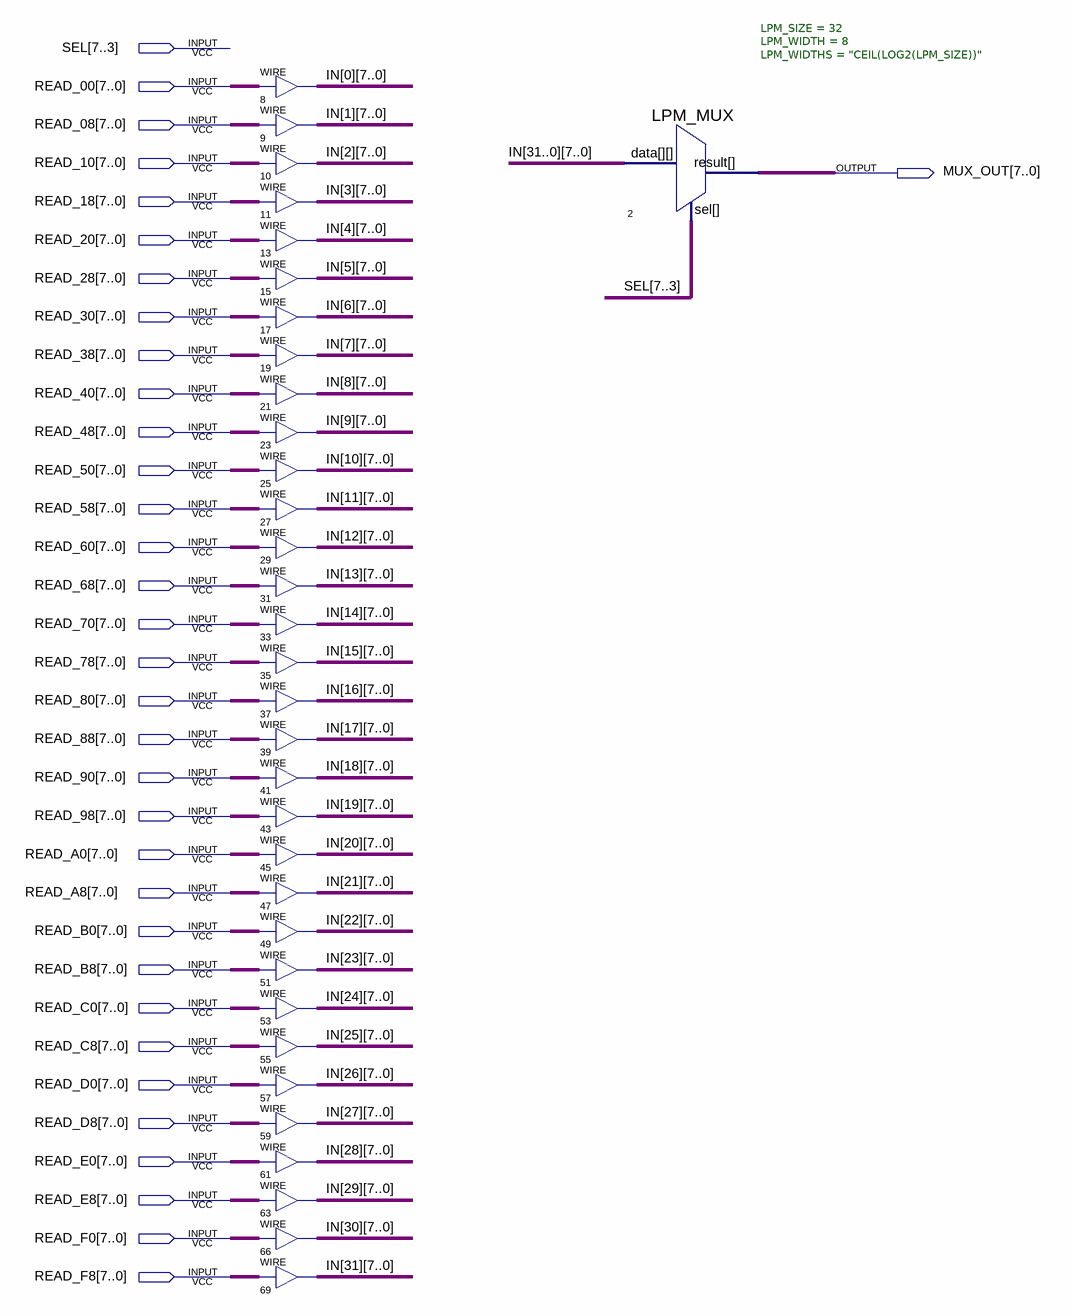
[diagram p0: schematic sheet]
// Quartus schematic mux32.bdf as structural Verilog: 33 symbols, 34 pins
module mux32 (
  input  [7:3] SEL,
  input  [7:0] READ_00,
  input  [7:0] READ_08,
  input  [7:0] READ_10,
  input  [7:0] READ_18,
  input  [7:0] READ_20,
  input  [7:0] READ_28,
  input  [7:0] READ_30,
  input  [7:0] READ_38,
  input  [7:0] READ_40,
  input  [7:0] READ_48,
  input  [7:0] READ_50,
  input  [7:0] READ_58,
  input  [7:0] READ_60,
  input  [7:0] READ_68,
  input  [7:0] READ_70,
  input  [7:0] READ_78,
  input  [7:0] READ_80,
  input  [7:0] READ_88,
  input  [7:0] READ_90,
  input  [7:0] READ_98,
  input  [7:0] READ_A0,
  input  [7:0] READ_A8,
  input  [7:0] READ_B0,
  input  [7:0] READ_B8,
  input  [7:0] READ_C0,
  input  [7:0] READ_C8,
  input  [7:0] READ_D0,
  input  [7:0] READ_D8,
  input  [7:0] READ_E0,
  input  [7:0] READ_E8,
  input  [7:0] READ_F0,
  input  [7:0] READ_F8,
  output [7:0] MUX_OUT
);

  wire [7:0] IN_0, IN_1, IN_2, IN_3, IN_4, IN_5, IN_6, IN_7, IN_8, IN_9, IN_10, IN_11, IN_12, IN_13, IN_14,
       IN_15, IN_16, IN_17, IN_18, IN_19, IN_20, IN_21, IN_22, IN_23, IN_24, IN_25, IN_26, IN_27, IN_28,
       IN_29, IN_30, IN_31;

  assign IN_0 = READ_00;  // WIRE 8
  assign IN_1 = READ_08;  // WIRE 9
  assign IN_2 = READ_10;  // WIRE 10
  assign IN_3 = READ_18;  // WIRE 11
  assign IN_4 = READ_20;  // WIRE 13
  assign IN_5 = READ_28;  // WIRE 15
  assign IN_6 = READ_30;  // WIRE 17
  assign IN_7 = READ_38;  // WIRE 19
  assign IN_8 = READ_40;  // WIRE 21
  assign IN_9 = READ_48;  // WIRE 23
  assign IN_10 = READ_50;  // WIRE 25
  assign IN_11 = READ_58;  // WIRE 27
  assign IN_12 = READ_60;  // WIRE 29
  assign IN_13 = READ_68;  // WIRE 31
  assign IN_14 = READ_70;  // WIRE 33
  assign IN_15 = READ_78;  // WIRE 35
  assign IN_16 = READ_80;  // WIRE 37
  assign IN_17 = READ_88;  // WIRE 39
  assign IN_18 = READ_90;  // WIRE 41
  assign IN_19 = READ_98;  // WIRE 43
  assign IN_20 = READ_A0;  // WIRE 45
  assign IN_21 = READ_A8;  // WIRE 47
  assign IN_22 = READ_B0;  // WIRE 49
  assign IN_23 = READ_B8;  // WIRE 51
  assign IN_24 = READ_C0;  // WIRE 53
  assign IN_25 = READ_C8;  // WIRE 55
  assign IN_26 = READ_D0;  // WIRE 57
  assign IN_27 = READ_D8;  // WIRE 59
  assign IN_28 = READ_E0;  // WIRE 61
  assign IN_29 = READ_E8;  // WIRE 63
  assign IN_30 = READ_F0;  // WIRE 66
  assign IN_31 = READ_F8;  // WIRE 69
  LPM_MUX #(.LPM_SIZE(32), .LPM_WIDTH(8), .LPM_WIDTHS("CEIL(LOG2(LPM_SIZE))")) u_2 (
    .data({IN_31, IN_30, IN_29, IN_28, IN_27, IN_26, IN_25, IN_24, IN_23, IN_22, IN_21, IN_20, IN_19, IN_18, IN_17, IN_16, IN_15, IN_14, IN_13, IN_12, IN_11, IN_10, IN_9, IN_8, IN_7, IN_6, IN_5, IN_4, IN_3, IN_2, IN_1, IN_0}),
    .sel(SEL), .result(MUX_OUT));
endmodule
